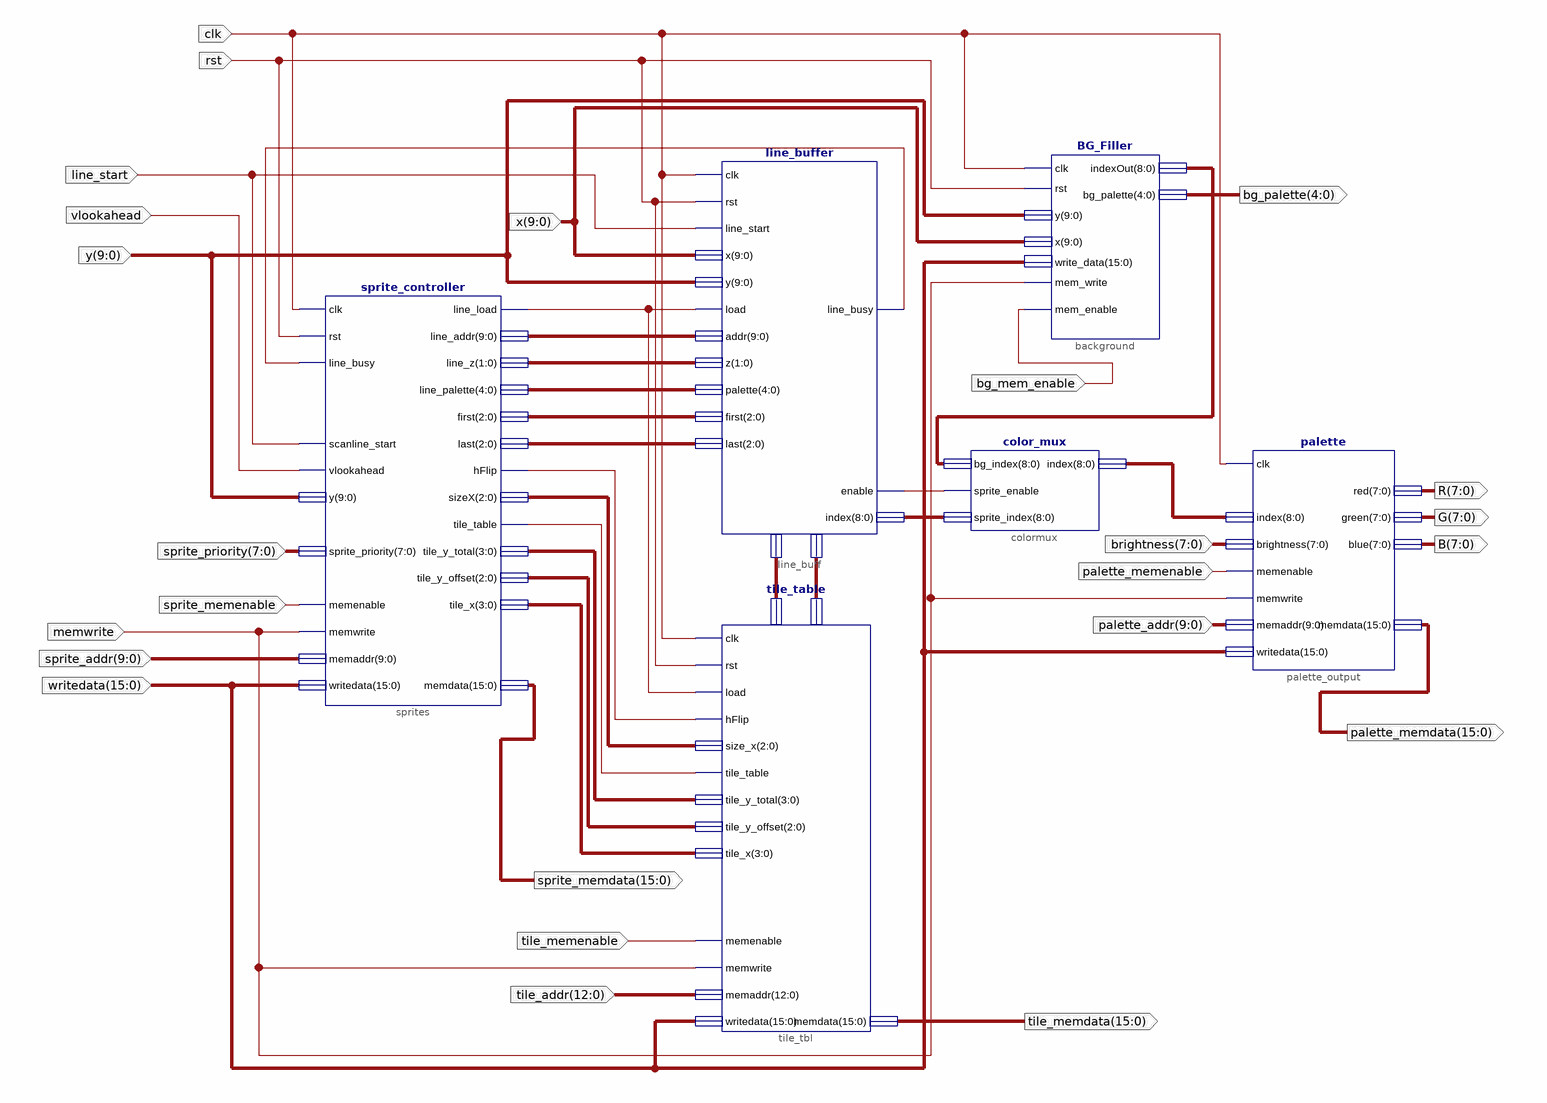
[diagram p0: schematic sheet 1]
// Xilinx ISE schematic gpu_schematic.sch (spartan3e) as structural Verilog: 6 symbols, 24 ports
module gpu_schematic (
  input  [15:0] writedata,
  input  [9:0] y,
  input  vlookahead,
  input  line_start,
  input  [12:0] tile_addr,
  input  [9:0] sprite_addr,
  input  [9:0] palette_addr,
  input  [7:0] brightness,
  input  sprite_memenable,
  input  memwrite,
  input  [9:0] x,
  input  tile_memenable,
  input  clk,
  input  palette_memenable,
  input  [7:0] sprite_priority,
  input  rst,
  input  bg_mem_enable,
  output [15:0] tile_memdata,
  output [15:0] sprite_memdata,
  output [7:0] R,
  output [7:0] G,
  output [7:0] B,
  output [15:0] palette_memdata,
  output [4:0] bg_palette
);

  wire XLXN_273, XLXN_319, XLXN_515, XLXN_517, XLXN_550;
  wire [1:0] XLXN_511;
  wire [2:0] XLXN_513, XLXN_514, XLXN_516, XLXN_519;
  wire [3:0] XLXN_518, XLXN_520, XLXN_529;
  wire [4:0] XLXN_532;
  wire [8:0] XLXN_551, XLXN_552, XLXN_553;
  wire [9:0] XLXN_510;
  wire [31:0] XLXN_531;

  line_buffer line_buff (
    .load(XLXN_319), .line_busy(XLXN_273), .addr(XLXN_510), .z(XLXN_511), .palette(XLXN_532),
    .first(XLXN_513), .last(XLXN_514), .enable(XLXN_550), .index(XLXN_551), .current_tile(XLXN_529),
    .tile_data(XLXN_531), .y(y), .x(x), .clk(clk), .rst(rst), .line_start(line_start));
  palette palette_output (
    .clk(clk), .index(XLXN_553), .brightness(brightness), .red(R), .green(G), .blue(B),
    .writedata(writedata), .memwrite(memwrite), .memaddr(palette_addr), .memdata(palette_memdata),
    .memenable(palette_memenable));
  sprite_controller sprites (
    .clk(clk), .rst(rst), .y(y), .line_busy(XLXN_273), .writedata(writedata), .memwrite(memwrite),
    .memaddr(sprite_addr), .memenable(sprite_memenable), .scanline_start(line_start),
    .vlookahead(vlookahead), .sprite_priority(sprite_priority), .tile_table(XLXN_517), .sizeX(XLXN_516),
    .hFlip(XLXN_515), .tile_y_total(XLXN_518), .tile_y_offset(XLXN_519), .tile_x(XLXN_520), .first(XLXN_513),
    .last(XLXN_514), .line_addr(XLXN_510), .line_z(XLXN_511), .line_palette(XLXN_532), .line_load(XLXN_319),
    .memdata(sprite_memdata));
  tile_table tile_tbl (
    .clk(clk), .rst(rst), .load(XLXN_319), .hFlip(XLXN_515), .size_x(XLXN_516), .tile_y_total(XLXN_518),
    .tile_y_offset(XLXN_519), .tile_table(XLXN_517), .tile_x(XLXN_520), .memenable(tile_memenable),
    .memwrite(memwrite), .memaddr(tile_addr), .writedata(writedata), .memdata(tile_memdata),
    .current_tile(XLXN_529), .tile_data(XLXN_531));
  BG_Filler background (
    .clk(clk), .x(x), .y(y), .rst(rst), .write_data(writedata), .mem_write(memwrite),
    .mem_enable(bg_mem_enable), .bg_palette(bg_palette), .indexOut(XLXN_552));
  color_mux colormux (.index(XLXN_553), .bg_index(XLXN_552), .sprite_enable(XLXN_550), .sprite_index(XLXN_551));
endmodule
